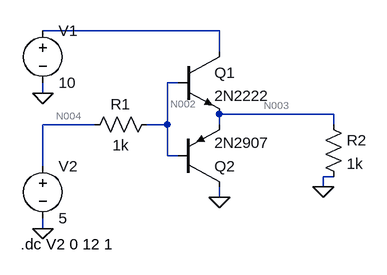
[diagram p0: schematic Draft2.asc]
Draft2.asc, the LTspice schematic file:
Version 4
SHEET 1 880 680
WIRE 240 48 -32 48
WIRE 240 80 240 48
WIRE 176 128 160 128
WIRE -32 144 -32 128
WIRE 416 176 240 176
WIRE 48 192 -32 192
WIRE 160 192 160 128
WIRE 160 192 128 192
WIRE 240 192 240 176
WIRE 416 192 416 176
WIRE 160 240 160 192
WIRE 176 240 160 240
WIRE -32 256 -32 192
WIRE 416 272 400 272
WIRE 400 288 400 272
WIRE 240 304 240 288
WIRE -32 352 -32 336
FLAG 240 304 0
FLAG -32 144 0
FLAG -32 352 0
FLAG 400 288 0
SYMBOL npn 176 80 R0
SYMATTR InstName Q1
SYMATTR Value 2N2222
SYMBOL pnp 176 288 M180
SYMATTR InstName Q2
SYMATTR Value 2N2907
SYMBOL voltage -32 32 R0
WINDOW 123 0 0 Left 0
WINDOW 39 0 0 Left 0
SYMATTR InstName V1
SYMATTR Value 10
SYMBOL voltage -32 240 R0
WINDOW 123 0 0 Left 0
WINDOW 39 0 0 Left 0
SYMATTR InstName V2
SYMATTR Value 5
SYMBOL res 144 176 R90
WINDOW 0 0 56 VBottom 2
WINDOW 3 32 56 VTop 2
SYMATTR InstName R1
SYMATTR Value 1k
SYMBOL res 400 176 R0
SYMATTR InstName R2
SYMATTR Value 1k
TEXT -66 376 Left 2 !.dc V2 0 12 1

The netlist it stands for:
* Draft2.asc
Q1 N001 N002 N003 0 2N2222
Q2 0 N002 N003 0 2N2907
V1 N001 0 10
V2 N004 0 5
R1 N002 N004 1k
R2 N003 0 1k
.model NPN NPN
.model PNP PNP
.lib standard.bjt
.dc V2 0 12 1
.backanno
.end

* Results of the author's LTspice run, read from the files saved beside the schematic
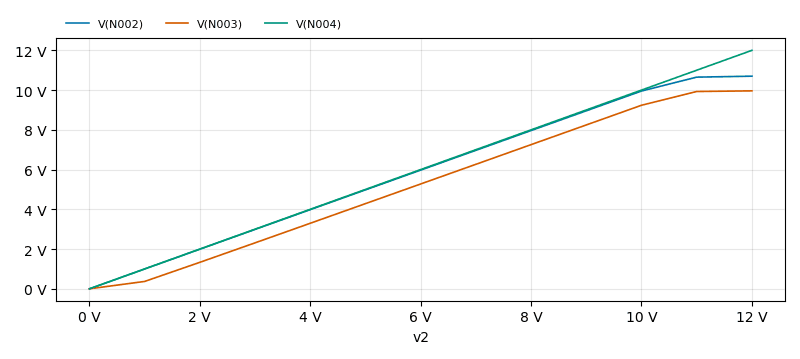
[diagram p1: DC transfer characteristic of Draft2.asc, plotted from the saved traces]
* DC transfer characteristic, 1 run:
*   V(N002): 10 nV at v2=0 V, 10.7 V at v2=12 V, min 10 nV, max 10.7 V
*   V(N003): 11 pV at v2=0 V, 9.962 V at v2=12 V, min 11 pV, max 9.962 V
*   V(N004): 0 V at v2=0 V, 12 V at v2=12 V, min 0 V, max 12 V